# Altium schematic sheet LEDS - Status.SchDoc
size A4
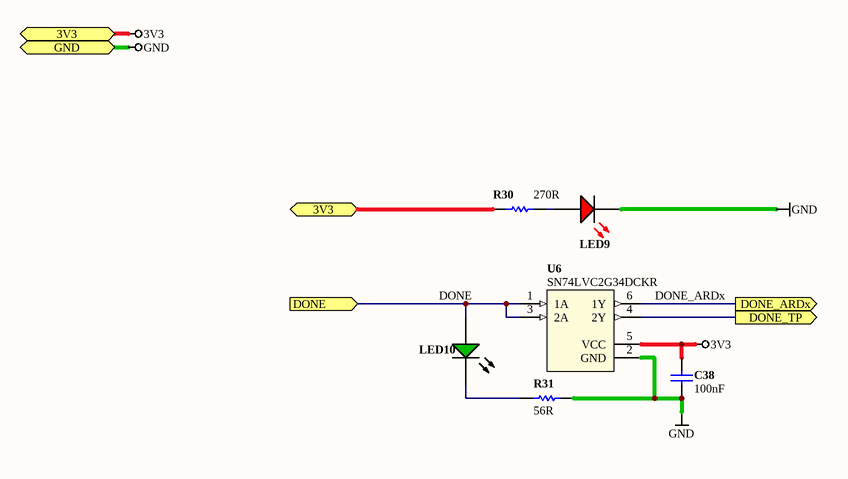
[diagram p0: LEDS - Status.SchDoc]

## Parts
C38  value 100nF  [CAPC0402(1005)60_L]  (hidden comment: CAP 100nF 10V 0402(1005))
LED9  0402-LED-RED  [LED_0402]  (value not drawn)
LED10  LED_GREEN_APT1608SGC  [LED0603]  (value not drawn)
R30  value 270R  [RESC0402(1005)40_L]  (hidden comment: 270R 1 0402)
R31  value 56R  [RESC0402(1005)_L]  (hidden comment: 56R 1% 0402(1005))
U6  SN74LVC2G34DCKR  [TI-DCK6_L]

## Ports
3V3, DONE (in), DONE_ARDx (out), DONE_TP (out), GND

## Nets
3V3: C38.2 R30.1 U6.5(VCC) ; port 3V3
GND: C38.1 LED9.2(K) R31.2 U6.2(GND) ; port GND
DONE: LED10.1(A) U6.1(1A) U6.3(2A) ; port DONE
DONE_ARDx: U6.6(1Y) ; port DONE_ARDx
DONE_TP: U6.4(2Y) ; port DONE_TP
NetLED9_1: LED9.1(A) R30.2
NetLED10_2: LED10.2(K) R31.1

## Library data of the parts
C38 = CMP-1034-02064-1: CAP 100nF 10V ±5% 0402 (1005 Metric) Thickness 0.6mm SMD; Manufacturer_PN: C0402C104K8PACTU; Case-EIA: 0402; Case-Metric: 1005; Max Thickness: 0.6 mm; Tolerance: ±5%; Rated Voltage: 10 V; Technology: SMT; Manufacturer Part Number: C0402C104K8PACTU
LED9 = CMP-0201-0013: 0402 LED,RED; Manufacturer_PN: LTST-C190KRKT; DefaultDesignator: LED?; Class: Diodes; Current Average (Io): 1.8V; ID: CMP-0201-0013; Sub Class: LED; Reverse Voltage DC (Vr): Red; ComponentLink1Description: Datasheet; ComponentLink1URL: http://optoelectronics.liteon.com/upload/download/DS-22-99-0151/S_110_LTST-C190KRKT.pdf; ComponentLink2Description: Manufacturer; ComponentLink2URL: www.liteon.com; Manufacturer Part Number: LTST-C190KRKT
LED10 = LED_GREEN_APT1608SGC: SMD 0603 LED, GREEN; DefaultDesignator: LED?; Class: Diodes; Forward Voltage (Vf): 2.2V; PartNumber: APT1608SGC; Sub Class: LED; Color: Green; Manufacturer_PN: APT1608SGC; Manufacturer Part Number: APT1608SGC
R30 = CMP-0503-0059: 0402 (1005 Metric) 1/16 W 270R 1 Thick Film Chip Resistor; Manufacturer_PN: RC1005F271CS; Case-EIA: 0402; Case-Metric: 1005; Temp Coefficient ppm/°C: ±100; Tolerance %: 1%; Value (Ohms): 270; Power: 1/16 W; ID: CMP-0503-0059; Technology: SMT; Manufacturer Part Number: RC1005F271CS
R31 = CMP-1011-00369-1: 56R 0.063W 1% 0402 (1005 Metric)  SMD; Manufacturer_PN: RC0402FR-0756RL; Case-Metric: 1005; Case-EIA: 0402; Power: 0.063 W; Tolerance: 1 %; Technology: SMT; Manufacturer Part Number: RC0402FR-0756RL
U6 = SN74LVC2G34DCKR: IC BUFFER DUAL NON-INV SC706; Manufacturer: Texas Instruments; DefaultDesignator: U?; Class: Logic; Sub Class: Buffer-Line Driver; Description2: IC BUFF/DVR TRI-ST OCTAL 20-VQFN; Logic Type: Buffer/Line Driver, Non-Inverting; Number of Elements: 2; Number of Bits per Element: 4; Current - Output High, Low: 24mA, 24mA; Voltage - Supply: 1.65 V ~ 3.6 V; PartNumber: SN74LVC2G34DCKR; ComponentLink1Description: Datasheet; ComponentLink1URL: http://www.ti.com/lit/ds/symlink/sn74lvc2g34.pdf; ComponentLink2Description: Manufacturer; ComponentLink2URL: www.ti.com; Series: 74LVC; Operating Temperature: -40°C ~ 125°C; Manufacturer_PN: SN74LVC2G34DCKR; Manufacturer Part Number: SN74LVC2G34DCKR